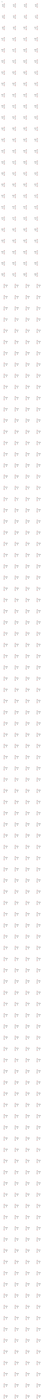
[diagram p0: schematic circuit.asc, whole sheet]
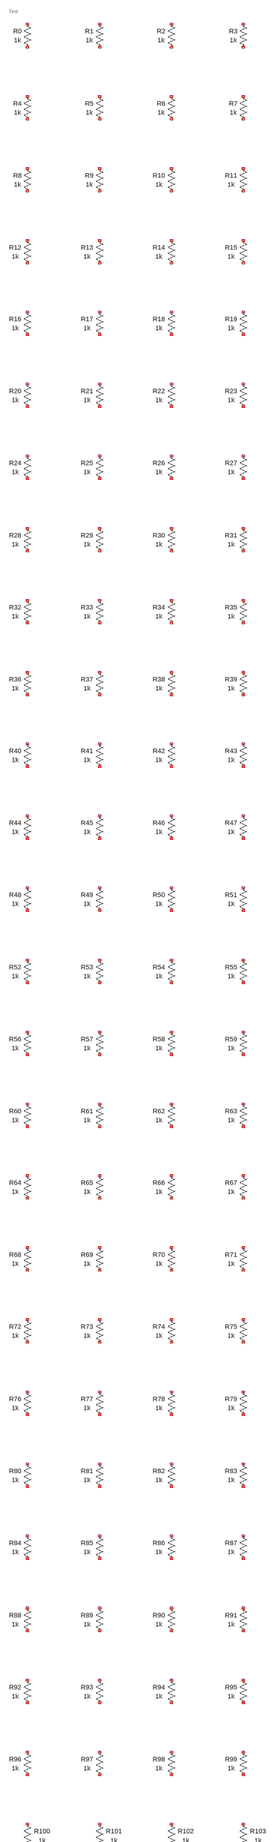
[diagram p1: schematic circuit.asc, part, row 1 of 5, column 1 of 1]
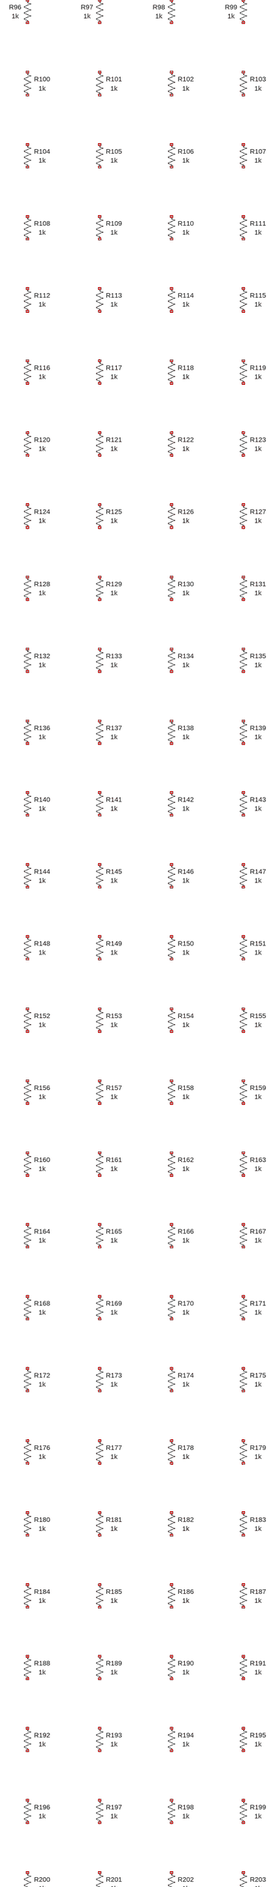
[diagram p2: schematic circuit.asc, part, row 2 of 5, column 1 of 1]
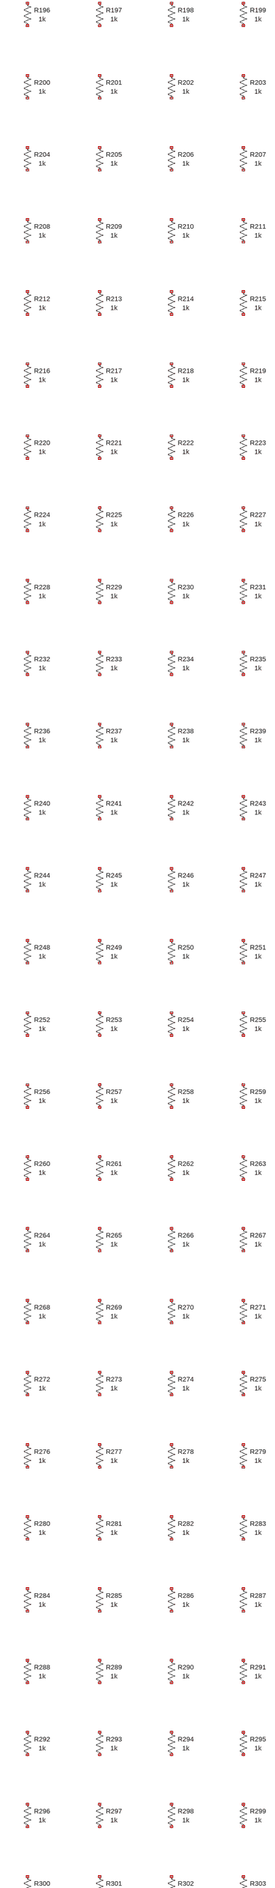
[diagram p3: schematic circuit.asc, part, row 3 of 5, column 1 of 1]
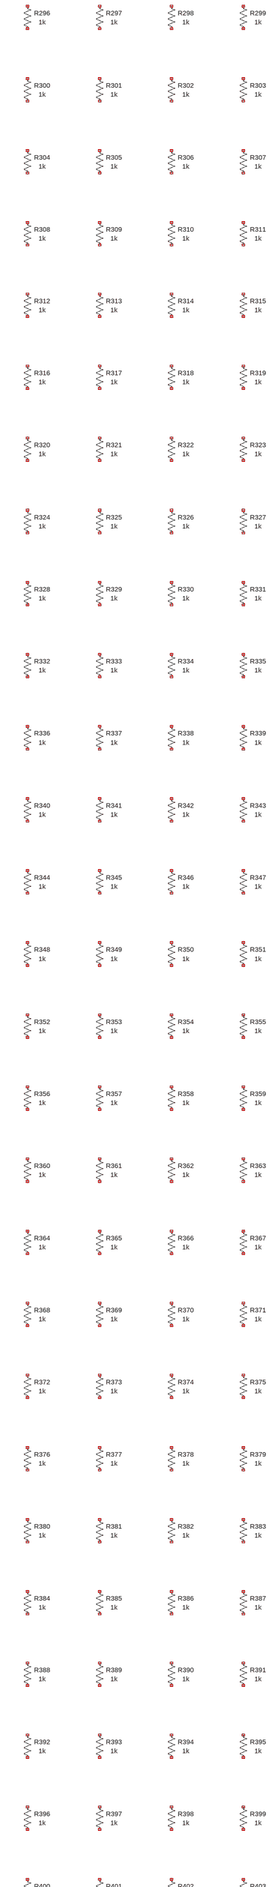
[diagram p4: schematic circuit.asc, part, row 4 of 5, column 1 of 1]
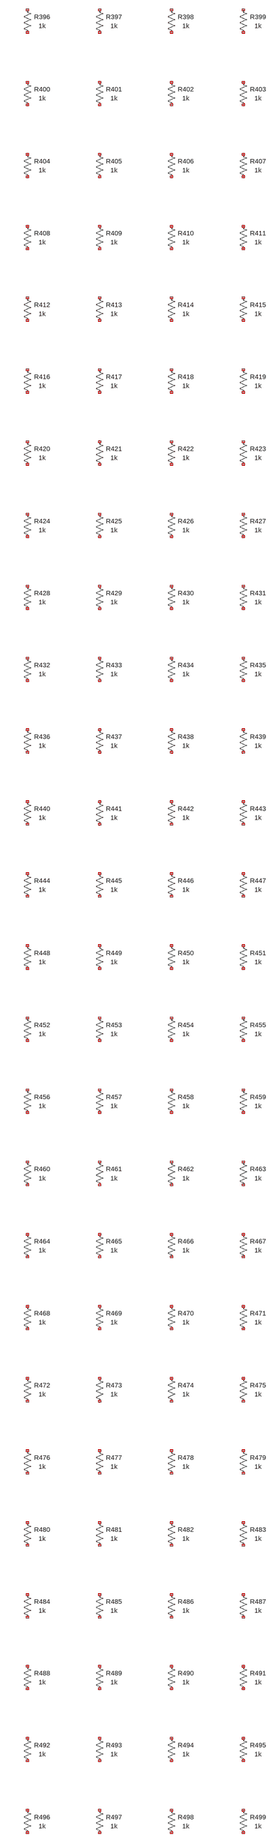
[diagram p5: schematic circuit.asc, part, row 5 of 5, column 1 of 1]
* circuit.asc
R0 NC_01 NC_02 1k
R1 NC_03 NC_04 1k
R2 NC_05 NC_06 1k
R3 NC_07 NC_08 1k
R4 NC_09 NC_10 1k
R5 NC_11 NC_12 1k
R6 NC_13 NC_14 1k
R7 NC_15 NC_16 1k
R8 NC_17 NC_18 1k
R9 NC_19 NC_20 1k
R10 NC_21 NC_22 1k
R11 NC_23 NC_24 1k
R12 NC_25 NC_26 1k
R13 NC_27 NC_28 1k
R14 NC_29 NC_30 1k
R15 NC_31 NC_32 1k
R16 NC_33 NC_34 1k
R17 NC_35 NC_36 1k
R18 NC_37 NC_38 1k
R19 NC_39 NC_40 1k
R20 NC_41 NC_42 1k
R21 NC_43 NC_44 1k
R22 NC_45 NC_46 1k
R23 NC_47 NC_48 1k
R24 NC_49 NC_50 1k
R25 NC_51 NC_52 1k
R26 NC_53 NC_54 1k
R27 NC_55 NC_56 1k
R28 NC_57 NC_58 1k
R29 NC_59 NC_60 1k
R30 NC_61 NC_62 1k
R31 NC_63 NC_64 1k
R32 NC_65 NC_66 1k
R33 NC_67 NC_68 1k
R34 NC_69 NC_70 1k
R35 NC_71 NC_72 1k
R36 NC_73 NC_74 1k
R37 NC_75 NC_76 1k
R38 NC_77 NC_78 1k
R39 NC_79 NC_80 1k
R40 NC_81 NC_82 1k
R41 NC_83 NC_84 1k
R42 NC_85 NC_86 1k
R43 NC_87 NC_88 1k
R44 NC_89 NC_90 1k
R45 NC_91 NC_92 1k
R46 NC_93 NC_94 1k
R47 NC_95 NC_96 1k
R48 NC_97 NC_98 1k
R49 NC_99 NC_100 1k
R50 NC_101 NC_102 1k
R51 NC_103 NC_104 1k
R52 NC_105 NC_106 1k
R53 NC_107 NC_108 1k
R54 NC_109 NC_110 1k
R55 NC_111 NC_112 1k
R56 NC_113 NC_114 1k
R57 NC_115 NC_116 1k
R58 NC_117 NC_118 1k
R59 NC_119 NC_120 1k
R60 NC_121 NC_122 1k
R61 NC_123 NC_124 1k
R62 NC_125 NC_126 1k
R63 NC_127 NC_128 1k
R64 NC_129 NC_130 1k
R65 NC_131 NC_132 1k
R66 NC_133 NC_134 1k
R67 NC_135 NC_136 1k
R68 NC_137 NC_138 1k
R69 NC_139 NC_140 1k
R70 NC_141 NC_142 1k
R71 NC_143 NC_144 1k
R72 NC_145 NC_146 1k
R73 NC_147 NC_148 1k
R74 NC_149 NC_150 1k
R75 NC_151 NC_152 1k
R76 NC_153 NC_154 1k
R77 NC_155 NC_156 1k
R78 NC_157 NC_158 1k
R79 NC_159 NC_160 1k
R80 NC_161 NC_162 1k
R81 NC_163 NC_164 1k
R82 NC_165 NC_166 1k
R83 NC_167 NC_168 1k
R84 NC_169 NC_170 1k
R85 NC_171 NC_172 1k
R86 NC_173 NC_174 1k
R87 NC_175 NC_176 1k
R88 NC_177 NC_178 1k
R89 NC_179 NC_180 1k
R90 NC_181 NC_182 1k
R91 NC_183 NC_184 1k
R92 NC_185 NC_186 1k
R93 NC_187 NC_188 1k
R94 NC_189 NC_190 1k
R95 NC_191 NC_192 1k
R96 NC_193 NC_194 1k
R97 NC_195 NC_196 1k
R98 NC_197 NC_198 1k
R99 NC_199 NC_200 1k
R100 NC_201 NC_202 1k
R101 NC_203 NC_204 1k
R102 NC_205 NC_206 1k
R103 NC_207 NC_208 1k
R104 NC_209 NC_210 1k
R105 NC_211 NC_212 1k
R106 NC_213 NC_214 1k
R107 NC_215 NC_216 1k
R108 NC_217 NC_218 1k
R109 NC_219 NC_220 1k
R110 NC_221 NC_222 1k
R111 NC_223 NC_224 1k
R112 NC_225 NC_226 1k
R113 NC_227 NC_228 1k
R114 NC_229 NC_230 1k
R115 NC_231 NC_232 1k
R116 NC_233 NC_234 1k
R117 NC_235 NC_236 1k
R118 NC_237 NC_238 1k
R119 NC_239 NC_240 1k
R120 NC_241 NC_242 1k
R121 NC_243 NC_244 1k
R122 NC_245 NC_246 1k
R123 NC_247 NC_248 1k
R124 NC_249 NC_250 1k
R125 NC_251 NC_252 1k
R126 NC_253 NC_254 1k
R127 NC_255 NC_256 1k
R128 NC_257 NC_258 1k
R129 NC_259 NC_260 1k
R130 NC_261 NC_262 1k
R131 NC_263 NC_264 1k
R132 NC_265 NC_266 1k
R133 NC_267 NC_268 1k
R134 NC_269 NC_270 1k
R135 NC_271 NC_272 1k
R136 NC_273 NC_274 1k
R137 NC_275 NC_276 1k
R138 NC_277 NC_278 1k
R139 NC_279 NC_280 1k
R140 NC_281 NC_282 1k
R141 NC_283 NC_284 1k
R142 NC_285 NC_286 1k
R143 NC_287 NC_288 1k
R144 NC_289 NC_290 1k
R145 NC_291 NC_292 1k
R146 NC_293 NC_294 1k
R147 NC_295 NC_296 1k
R148 NC_297 NC_298 1k
R149 NC_299 NC_300 1k
R150 NC_301 NC_302 1k
R151 NC_303 NC_304 1k
R152 NC_305 NC_306 1k
R153 NC_307 NC_308 1k
R154 NC_309 NC_310 1k
R155 NC_311 NC_312 1k
R156 NC_313 NC_314 1k
R157 NC_315 NC_316 1k
R158 NC_317 NC_318 1k
R159 NC_319 NC_320 1k
R160 NC_321 NC_322 1k
R161 NC_323 NC_324 1k
R162 NC_325 NC_326 1k
R163 NC_327 NC_328 1k
R164 NC_329 NC_330 1k
R165 NC_331 NC_332 1k
R166 NC_333 NC_334 1k
R167 NC_335 NC_336 1k
R168 NC_337 NC_338 1k
R169 NC_339 NC_340 1k
R170 NC_341 NC_342 1k
R171 NC_343 NC_344 1k
R172 NC_345 NC_346 1k
R173 NC_347 NC_348 1k
R174 NC_349 NC_350 1k
R175 NC_351 NC_352 1k
R176 NC_353 NC_354 1k
R177 NC_355 NC_356 1k
R178 NC_357 NC_358 1k
R179 NC_359 NC_360 1k
R180 NC_361 NC_362 1k
R181 NC_363 NC_364 1k
R182 NC_365 NC_366 1k
R183 NC_367 NC_368 1k
R184 NC_369 NC_370 1k
R185 NC_371 NC_372 1k
R186 NC_373 NC_374 1k
R187 NC_375 NC_376 1k
R188 NC_377 NC_378 1k
R189 NC_379 NC_380 1k
R190 NC_381 NC_382 1k
R191 NC_383 NC_384 1k
R192 NC_385 NC_386 1k
R193 NC_387 NC_388 1k
R194 NC_389 NC_390 1k
R195 NC_391 NC_392 1k
R196 NC_393 NC_394 1k
R197 NC_395 NC_396 1k
R198 NC_397 NC_398 1k
R199 NC_399 NC_400 1k
R200 NC_401 NC_402 1k
R201 NC_403 NC_404 1k
R202 NC_405 NC_406 1k
R203 NC_407 NC_408 1k
R204 NC_409 NC_410 1k
R205 NC_411 NC_412 1k
R206 NC_413 NC_414 1k
R207 NC_415 NC_416 1k
R208 NC_417 NC_418 1k
R209 NC_419 NC_420 1k
R210 NC_421 NC_422 1k
R211 NC_423 NC_424 1k
R212 NC_425 NC_426 1k
R213 NC_427 NC_428 1k
R214 NC_429 NC_430 1k
R215 NC_431 NC_432 1k
R216 NC_433 NC_434 1k
R217 NC_435 NC_436 1k
R218 NC_437 NC_438 1k
R219 NC_439 NC_440 1k
R220 NC_441 NC_442 1k
R221 NC_443 NC_444 1k
R222 NC_445 NC_446 1k
R223 NC_447 NC_448 1k
R224 NC_449 NC_450 1k
R225 NC_451 NC_452 1k
R226 NC_453 NC_454 1k
R227 NC_455 NC_456 1k
R228 NC_457 NC_458 1k
R229 NC_459 NC_460 1k
R230 NC_461 NC_462 1k
R231 NC_463 NC_464 1k
R232 NC_465 NC_466 1k
R233 NC_467 NC_468 1k
R234 NC_469 NC_470 1k
R235 NC_471 NC_472 1k
R236 NC_473 NC_474 1k
R237 NC_475 NC_476 1k
R238 NC_477 NC_478 1k
R239 NC_479 NC_480 1k
R240 NC_481 NC_482 1k
R241 NC_483 NC_484 1k
R242 NC_485 NC_486 1k
R243 NC_487 NC_488 1k
R244 NC_489 NC_490 1k
R245 NC_491 NC_492 1k
R246 NC_493 NC_494 1k
R247 NC_495 NC_496 1k
R248 NC_497 NC_498 1k
R249 NC_499 NC_500 1k
R250 NC_501 NC_502 1k
R251 NC_503 NC_504 1k
R252 NC_505 NC_506 1k
R253 NC_507 NC_508 1k
R254 NC_509 NC_510 1k
R255 NC_511 NC_512 1k
R256 NC_513 NC_514 1k
R257 NC_515 NC_516 1k
R258 NC_517 NC_518 1k
R259 NC_519 NC_520 1k
R260 NC_521 NC_522 1k
R261 NC_523 NC_524 1k
R262 NC_525 NC_526 1k
R263 NC_527 NC_528 1k
R264 NC_529 NC_530 1k
R265 NC_531 NC_532 1k
R266 NC_533 NC_534 1k
R267 NC_535 NC_536 1k
R268 NC_537 NC_538 1k
R269 NC_539 NC_540 1k
R270 NC_541 NC_542 1k
R271 NC_543 NC_544 1k
R272 NC_545 NC_546 1k
R273 NC_547 NC_548 1k
R274 NC_549 NC_550 1k
R275 NC_551 NC_552 1k
R276 NC_553 NC_554 1k
R277 NC_555 NC_556 1k
R278 NC_557 NC_558 1k
R279 NC_559 NC_560 1k
R280 NC_561 NC_562 1k
R281 NC_563 NC_564 1k
R282 NC_565 NC_566 1k
R283 NC_567 NC_568 1k
R284 NC_569 NC_570 1k
R285 NC_571 NC_572 1k
R286 NC_573 NC_574 1k
R287 NC_575 NC_576 1k
R288 NC_577 NC_578 1k
R289 NC_579 NC_580 1k
R290 NC_581 NC_582 1k
R291 NC_583 NC_584 1k
R292 NC_585 NC_586 1k
R293 NC_587 NC_588 1k
R294 NC_589 NC_590 1k
R295 NC_591 NC_592 1k
R296 NC_593 NC_594 1k
R297 NC_595 NC_596 1k
R298 NC_597 NC_598 1k
R299 NC_599 NC_600 1k
R300 NC_601 NC_602 1k
R301 NC_603 NC_604 1k
R302 NC_605 NC_606 1k
R303 NC_607 NC_608 1k
R304 NC_609 NC_610 1k
R305 NC_611 NC_612 1k
R306 NC_613 NC_614 1k
R307 NC_615 NC_616 1k
R308 NC_617 NC_618 1k
R309 NC_619 NC_620 1k
R310 NC_621 NC_622 1k
R311 NC_623 NC_624 1k
R312 NC_625 NC_626 1k
R313 NC_627 NC_628 1k
R314 NC_629 NC_630 1k
R315 NC_631 NC_632 1k
R316 NC_633 NC_634 1k
R317 NC_635 NC_636 1k
R318 NC_637 NC_638 1k
R319 NC_639 NC_640 1k
R320 NC_641 NC_642 1k
R321 NC_643 NC_644 1k
R322 NC_645 NC_646 1k
R323 NC_647 NC_648 1k
R324 NC_649 NC_650 1k
R325 NC_651 NC_652 1k
R326 NC_653 NC_654 1k
R327 NC_655 NC_656 1k
R328 NC_657 NC_658 1k
R329 NC_659 NC_660 1k
R330 NC_661 NC_662 1k
R331 NC_663 NC_664 1k
R332 NC_665 NC_666 1k
R333 NC_667 NC_668 1k
R334 NC_669 NC_670 1k
R335 NC_671 NC_672 1k
R336 NC_673 NC_674 1k
R337 NC_675 NC_676 1k
R338 NC_677 NC_678 1k
R339 NC_679 NC_680 1k
R340 NC_681 NC_682 1k
R341 NC_683 NC_684 1k
R342 NC_685 NC_686 1k
R343 NC_687 NC_688 1k
R344 NC_689 NC_690 1k
R345 NC_691 NC_692 1k
R346 NC_693 NC_694 1k
R347 NC_695 NC_696 1k
R348 NC_697 NC_698 1k
R349 NC_699 NC_700 1k
R350 NC_701 NC_702 1k
R351 NC_703 NC_704 1k
R352 NC_705 NC_706 1k
R353 NC_707 NC_708 1k
R354 NC_709 NC_710 1k
R355 NC_711 NC_712 1k
R356 NC_713 NC_714 1k
R357 NC_715 NC_716 1k
R358 NC_717 NC_718 1k
R359 NC_719 NC_720 1k
R360 NC_721 NC_722 1k
R361 NC_723 NC_724 1k
R362 NC_725 NC_726 1k
R363 NC_727 NC_728 1k
R364 NC_729 NC_730 1k
R365 NC_731 NC_732 1k
R366 NC_733 NC_734 1k
R367 NC_735 NC_736 1k
R368 NC_737 NC_738 1k
R369 NC_739 NC_740 1k
R370 NC_741 NC_742 1k
R371 NC_743 NC_744 1k
R372 NC_745 NC_746 1k
R373 NC_747 NC_748 1k
R374 NC_749 NC_750 1k
R375 NC_751 NC_752 1k
R376 NC_753 NC_754 1k
R377 NC_755 NC_756 1k
R378 NC_757 NC_758 1k
R379 NC_759 NC_760 1k
R380 NC_761 NC_762 1k
R381 NC_763 NC_764 1k
R382 NC_765 NC_766 1k
R383 NC_767 NC_768 1k
R384 NC_769 NC_770 1k
R385 NC_771 NC_772 1k
R386 NC_773 NC_774 1k
R387 NC_775 NC_776 1k
R388 NC_777 NC_778 1k
R389 NC_779 NC_780 1k
R390 NC_781 NC_782 1k
R391 NC_783 NC_784 1k
R392 NC_785 NC_786 1k
R393 NC_787 NC_788 1k
R394 NC_789 NC_790 1k
R395 NC_791 NC_792 1k
R396 NC_793 NC_794 1k
R397 NC_795 NC_796 1k
R398 NC_797 NC_798 1k
R399 NC_799 NC_800 1k
R400 NC_801 NC_802 1k
R401 NC_803 NC_804 1k
R402 NC_805 NC_806 1k
R403 NC_807 NC_808 1k
R404 NC_809 NC_810 1k
R405 NC_811 NC_812 1k
R406 NC_813 NC_814 1k
R407 NC_815 NC_816 1k
R408 NC_817 NC_818 1k
R409 NC_819 NC_820 1k
R410 NC_821 NC_822 1k
R411 NC_823 NC_824 1k
R412 NC_825 NC_826 1k
R413 NC_827 NC_828 1k
R414 NC_829 NC_830 1k
R415 NC_831 NC_832 1k
R416 NC_833 NC_834 1k
R417 NC_835 NC_836 1k
R418 NC_837 NC_838 1k
R419 NC_839 NC_840 1k
R420 NC_841 NC_842 1k
R421 NC_843 NC_844 1k
R422 NC_845 NC_846 1k
R423 NC_847 NC_848 1k
R424 NC_849 NC_850 1k
R425 NC_851 NC_852 1k
R426 NC_853 NC_854 1k
R427 NC_855 NC_856 1k
R428 NC_857 NC_858 1k
R429 NC_859 NC_860 1k
R430 NC_861 NC_862 1k
R431 NC_863 NC_864 1k
R432 NC_865 NC_866 1k
R433 NC_867 NC_868 1k
R434 NC_869 NC_870 1k
R435 NC_871 NC_872 1k
R436 NC_873 NC_874 1k
R437 NC_875 NC_876 1k
R438 NC_877 NC_878 1k
R439 NC_879 NC_880 1k
R440 NC_881 NC_882 1k
R441 NC_883 NC_884 1k
R442 NC_885 NC_886 1k
R443 NC_887 NC_888 1k
R444 NC_889 NC_890 1k
R445 NC_891 NC_892 1k
R446 NC_893 NC_894 1k
R447 NC_895 NC_896 1k
R448 NC_897 NC_898 1k
R449 NC_899 NC_900 1k
R450 NC_901 NC_902 1k
R451 NC_903 NC_904 1k
R452 NC_905 NC_906 1k
R453 NC_907 NC_908 1k
R454 NC_909 NC_910 1k
R455 NC_911 NC_912 1k
R456 NC_913 NC_914 1k
R457 NC_915 NC_916 1k
R458 NC_917 NC_918 1k
R459 NC_919 NC_920 1k
R460 NC_921 NC_922 1k
R461 NC_923 NC_924 1k
R462 NC_925 NC_926 1k
R463 NC_927 NC_928 1k
R464 NC_929 NC_930 1k
R465 NC_931 NC_932 1k
R466 NC_933 NC_934 1k
R467 NC_935 NC_936 1k
R468 NC_937 NC_938 1k
R469 NC_939 NC_940 1k
R470 NC_941 NC_942 1k
R471 NC_943 NC_944 1k
R472 NC_945 NC_946 1k
R473 NC_947 NC_948 1k
R474 NC_949 NC_950 1k
R475 NC_951 NC_952 1k
R476 NC_953 NC_954 1k
R477 NC_955 NC_956 1k
R478 NC_957 NC_958 1k
R479 NC_959 NC_960 1k
R480 NC_961 NC_962 1k
R481 NC_963 NC_964 1k
R482 NC_965 NC_966 1k
R483 NC_967 NC_968 1k
R484 NC_969 NC_970 1k
R485 NC_971 NC_972 1k
R486 NC_973 NC_974 1k
R487 NC_975 NC_976 1k
R488 NC_977 NC_978 1k
R489 NC_979 NC_980 1k
R490 NC_981 NC_982 1k
R491 NC_983 NC_984 1k
R492 NC_985 NC_986 1k
R493 NC_987 NC_988 1k
R494 NC_989 NC_990 1k
R495 NC_991 NC_992 1k
R496 NC_993 NC_994 1k
R497 NC_995 NC_996 1k
R498 NC_997 NC_998 1k
R499 NC_999 NC_1000 1k
* Test
.backanno
.end